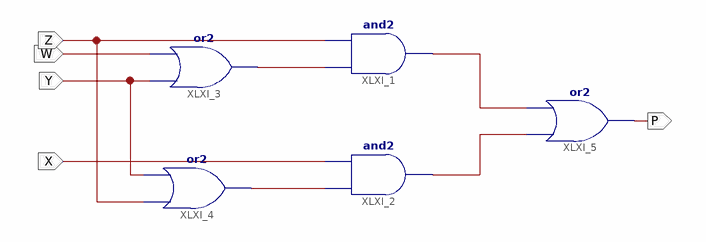
[diagram p0: schematic sheet 1]
// Xilinx ISE schematic Votecircuit1.sch (spartan3) as structural Verilog: 5 symbols, 5 ports
module Votecircuit1 (
  input  W,
  input  X,
  input  Y,
  input  Z,
  output P
);

  wire XLXN_1, XLXN_11, XLXN_17, XLXN_18;

  and XLXI_1 (XLXN_17, XLXN_1, Z);
  and XLXI_2 (XLXN_18, XLXN_11, X);
  or XLXI_3 (XLXN_1, Y, W);
  or XLXI_4 (XLXN_11, Z, Y);
  or XLXI_5 (P, XLXN_18, XLXN_17);
endmodule
